# EasyEDA schematic water_counter.json
TITLE: Counter_Water; REV: 1.0; Date: 2025-07-06; Sheet: 1/1; Company: Museum of Science
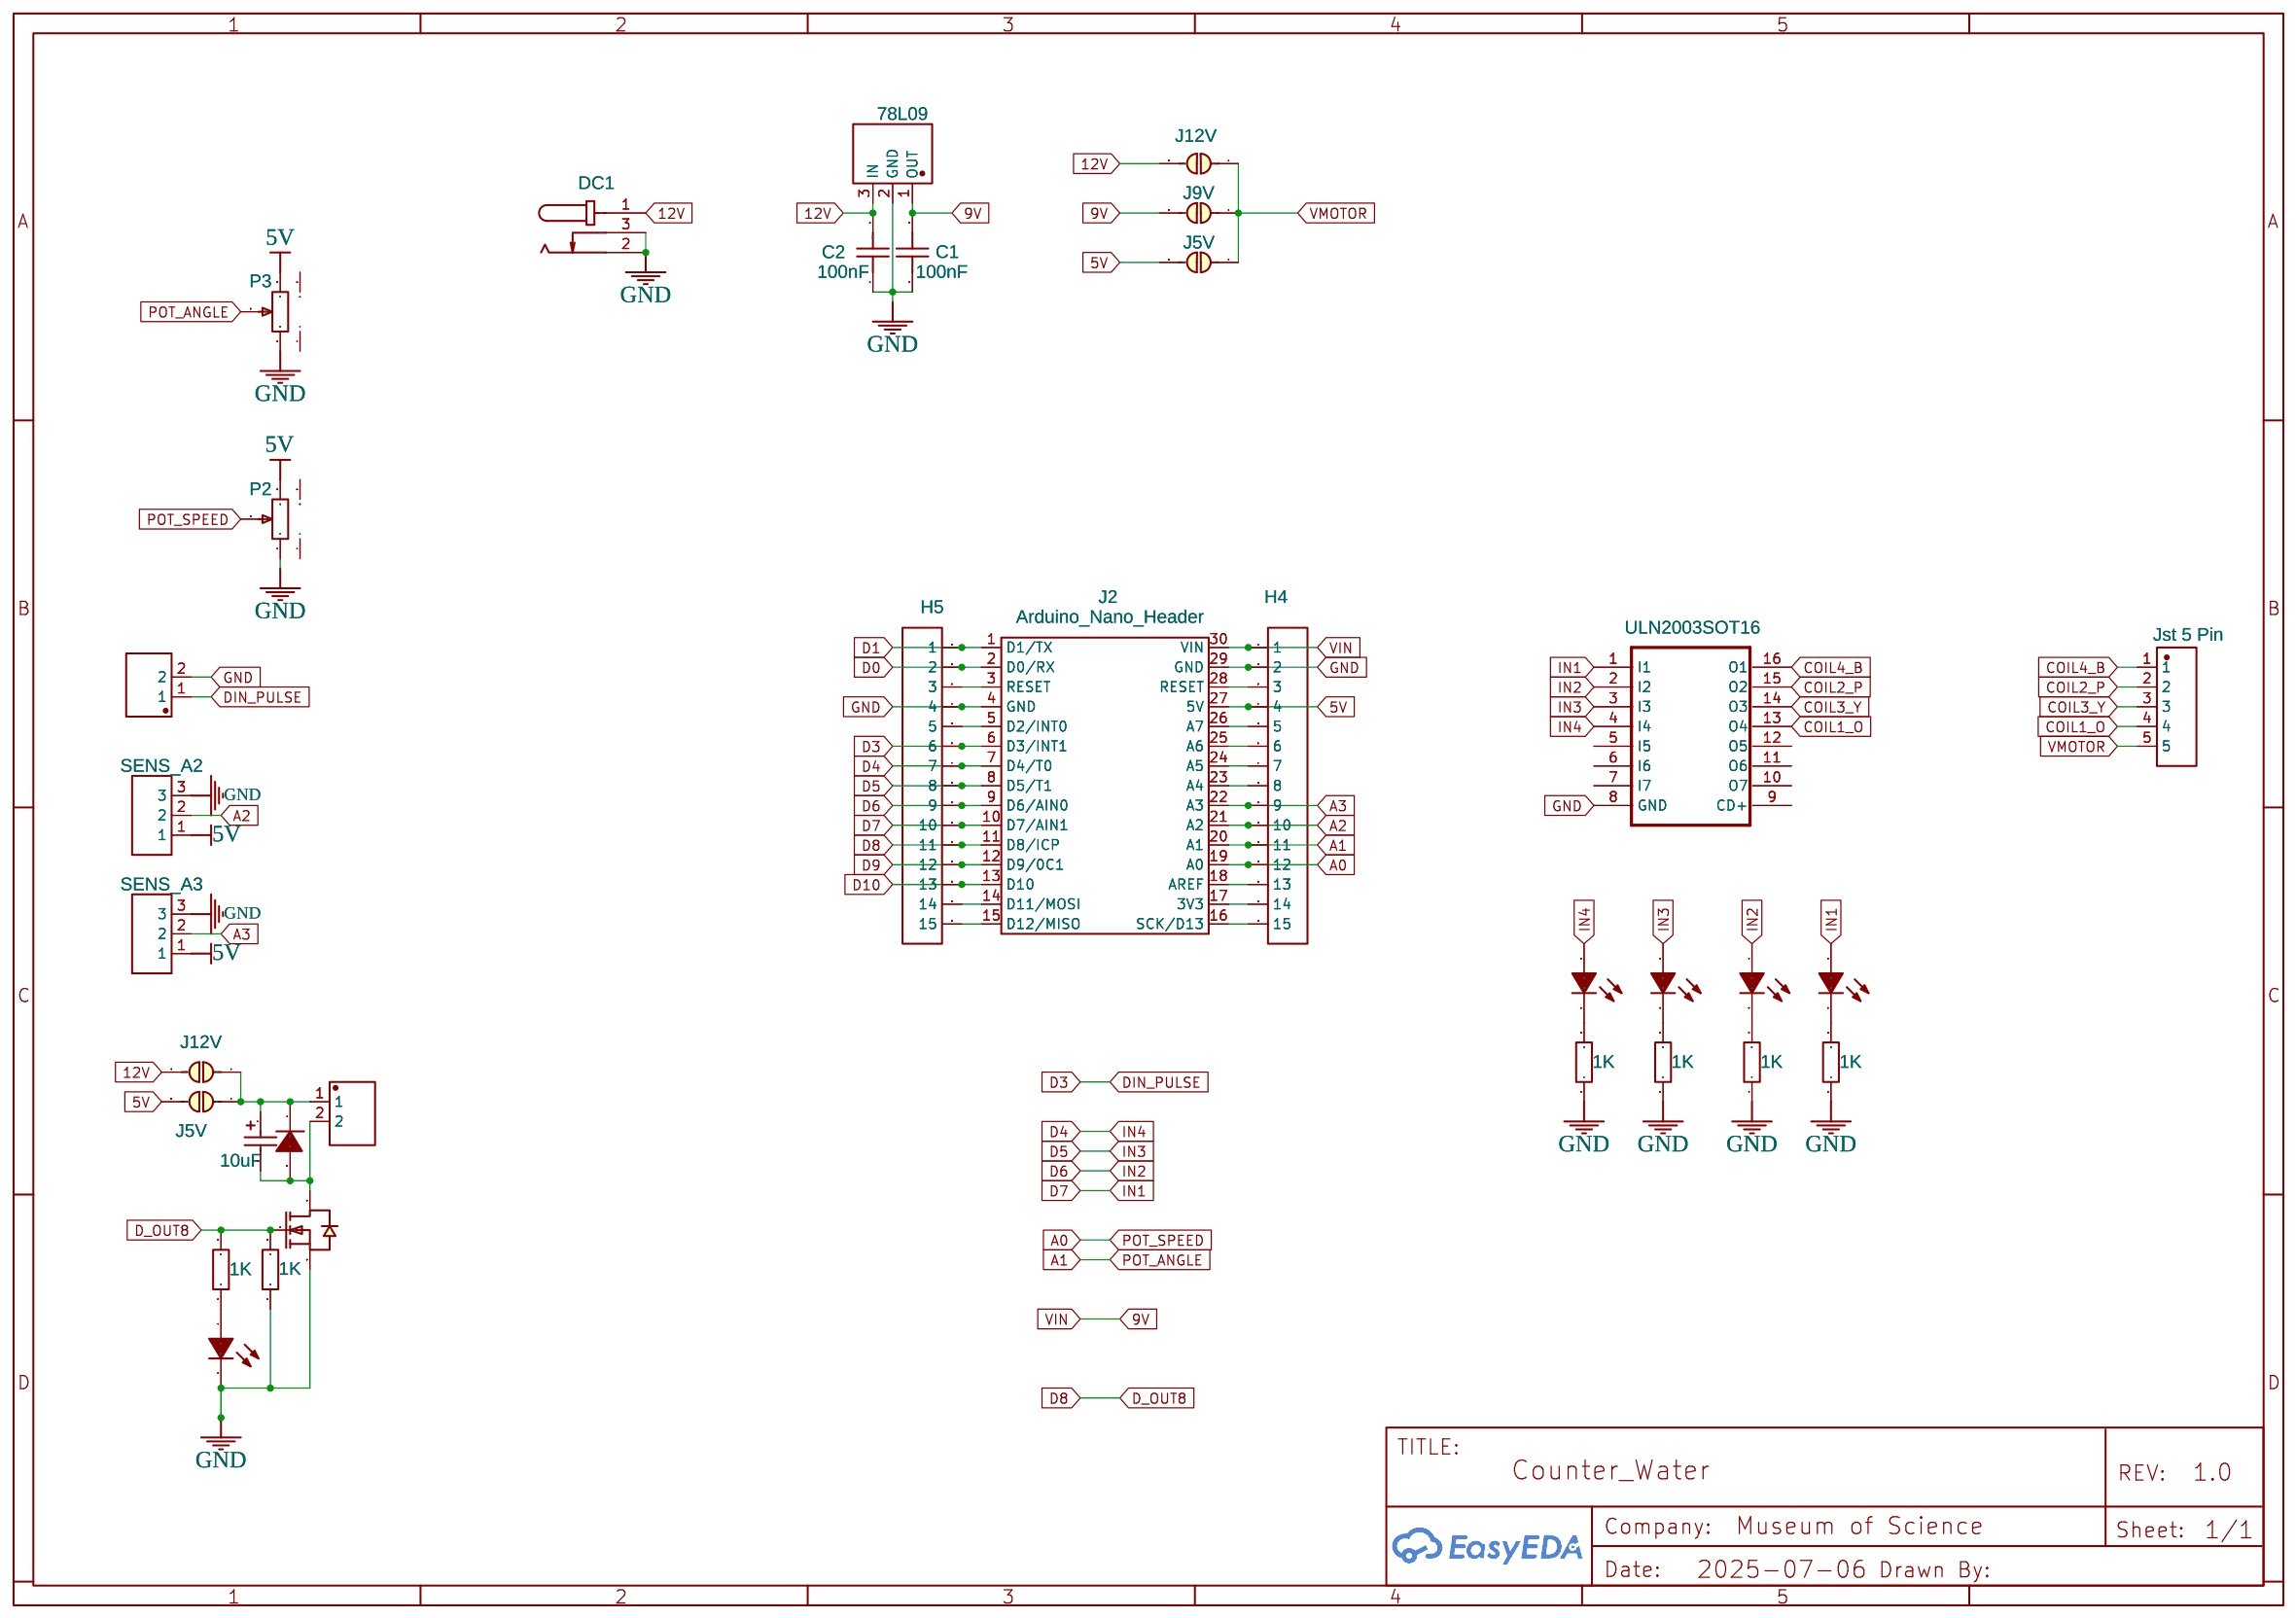
[diagram p0: schematic sheet]

## Parts
C1  100nF  [C0603]
C2  100nF  [C0603]
D3_PULSE  KF2510-2A  [CONN-TH_KF2510-2A]
DC1  DC  [DC-IN-TH_DC005]
ECM1  10uF  [CAP-SMD_L3.2-W1.6-RD-C7171]
ECON1  D_OUT8  [CONN-TH_KF2510-2A]
EDM1  1N4007  [SMAF_L3.5-W2.6-LS4.7-RD]
ELD1  LED  [LED0603-R-RD_BLUE]
ELD2  LED  [LED0603-R-RD_BLUE]
ELD3  LED  [LED0603-R-RD_BLUE]
ELD4  LED  [LED0603-R-RD_BLUE]
ELD5  LED  [LED0603-R-RD_BLUE]
EQ1  Q  [SOT-23-3_L2.9-W1.3-P0.95-LS2.4-BR]
ERG1  1K  [R0603]
ERL1  1K  [R0603]
ERL2  1K  [R0603]
ERL3  1K  [R0603]
ERL4  1K  [R0603]
ERL5  1K  [R0603]
H4  HDR-F-2.54_1x15  [HDR-F-2.54_1X15]
H5  HDR-F-2.54_1x15  [HDR-F-2.54_1X15]
IC1  ULN2003SOT16  [SOT16]
J2  Arduino_Nano_Header  [DIP-30_L43.18-W15.24-ARDUINONANO]
J5V_1  J5V  [JUMPERS_SMT-JUMPER_2_NC_PASTE_NO-SILK]
J5V_2  J5V  [JUMPERS_SMT-JUMPER_2_NC_PASTE_NO-SILK]
J9V_1  J9V  [JUMPERS_SMT-JUMPER_2_NC_PASTE_NO-SILK]
J12V_1  J12V  [JUMPERS_SMT-JUMPER_2_NC_PASTE_NO-SILK]
J12V_2  J12V  [JUMPERS_SMT-JUMPER_2_NC_PASTE_NO-SILK]
P2  长柄旋转电位器  [RES-ADJ-TH_RV09]
P3  长柄旋转电位器  [RES-ADJ-TH_RV09]
SENS_A2  FK2510  [CONN-TH_3P-P2.00_KF2510_3A]
SENS_A3  FK2510  [CONN-TH_3P-P2.00_KF2510_3A]
U1  78L09  [SOT-89-3_L4.5-W2.5-P1.50-LS4.0-BR]
U2  Jst 5 Pin  [JST 5 PIN]

## Library data of the parts
C1 C2 = CC0603KRX7R9BB104: JLCPCB Part Class: Basic Part; Package Display: No
D3_PULSE ECON1 = KF2510-2A: Supplier: LCSC; Manufacturer: BOOMELE; Supplier Part: C27543; JLCPCB Part Class: Extended Part; Package Display: No
DC1 = DC005-2.0MM: Supplier: LCSC; Manufacturer: SOFNG; Supplier Part: C111567; Package Display: No
ECM1 = TAJA106K016RNJ: JLCPCB Part Class: Basic Part; Package Display: No
EDM1 = 1N4007F: Supplier: LCSC; Manufacturer: SK; Supplier Part: C110856; JLCPCB Part Class: Extended Part; Package Display: No
ELD1-ELD5 = 19-217/BHC-ZL1M2RY/3T: Supplier: LCSC; Manufacturer: EVERLIGHT; Supplier Part: C72041; JLCPCB Part Class: Basic Part; Package Display: No
EQ1 = JSM2302: Supplier: LCSC; Supplier Part: C5224189; Manufacturer: ElecSuper(静芯微）; Manufacturer Part: AO3400; Contributor: LCSC; JLCPCB Part Class: Extended Part; Package Display: No
ERG1 ERL1-ERL5 = 0603WAF1001T5E: Supplier: LCSC; Manufacturer: UniOhm; Supplier Part: C21190; JLCPCB Part Class: Basic Part; Package Display: No
H4 H5 = HDR-F-2.54_1x15: Supplier Part: C124408; Supplier: LCSC; Contributor: LCEDA_Lib; Package Display: No
IC1 = ULN2003SOT16: Contributor: bobim; Hersteller: STMicroelectronics; Lieferant: Reichelt
J2 = Arduino_Nano_Header
J5V_1 J5V_2 J9V_1 J12V_1 J12V_2 = JUMPER-SMT_2: Contributor: P-Thomsen; Package Display: No
P2 P3 = 长柄旋转电位器: Supplier: LCSC; Supplier Part: C2874842; Manufacturer: null; JLCPCB Part Class: Extended Part; Contributor: LCSC; Package Display: No
SENS_A2 SENS_A3 = kf2510_3A: JLCPCB Part Class: Extended Part; Package Display: No
U1 = 78L09U 78L09: Contributor: LCSC; Supplier: LCSC; Supplier Part: C2875177; Manufacturer: CBI(创基); JLCPCB Part Class: Extended Part; Package Display: No
U2 = Jst 5 Pin: Manufacturer: Vicky; Supplier: Vicky; Contributor: waqasalivicky123

## Nets
5V: H4.4 J2.27(5V) J5V_1.2 J5V_2.2 P2.3 P3.3 SENS_A2.1 SENS_A3.1
9V: C1.2 H4.1 J2.30(VIN) J9V_1.2 U1.1(OUT)
12V: C2.2 DC1.1 J12V_1.2 J12V_2.2 U1.3(IN)
GND: C1.1 C2.1 D3_PULSE.2 DC1.2 DC1.3 ELD5.2(C) EQ1.2(S) ERG1.1 ERL1.1 ERL2.1 ERL3.1 ERL4.1 H4.2 H5.4 IC1.8(GND) J2.4(GND) J2.29(GND) P2.1 P3.1 SENS_A2.3 SENS_A3.3 U1.2(GND)
A0: H4.12 J2.19(A0) P2.2
A1: H4.11 J2.20(A1) P3.2
A2: H4.10 J2.21(A2) SENS_A2.2
A3: H4.9 J2.22(A3) SENS_A3.2
COIL1_O: IC1.13(O4) U2.4
COIL2_P: IC1.15(O2) U2.2
COIL3_Y: IC1.14(O3) U2.3
COIL4_B: IC1.16(O1) U2.1
D0: H5.2 J2.2(D0/RX)
D1: H5.1 J2.1(D1/TX)
D3: D3_PULSE.1 H5.6 J2.6(D3/INT1)
D4: ELD1.1(A) H5.7 IC1.4(I4) J2.7(D4/T0)
D5: ELD4.1(A) H5.8 IC1.3(I3) J2.8(D5/T1)
D6: ELD2.1(A) H5.9 IC1.2(I2) J2.9(D6/AIN0)
D7: ELD3.1(A) H5.10 IC1.1(I1) J2.10(D7/AIN1)
D8: EQ1.1(G) ERG1.2 ERL5.2 H5.11 J2.11(D8/ICP)
D9: H5.12 J2.12(D9/0C1)
D10: H5.13 J2.13(D10)
VMOTOR: J5V_1.1 J9V_1.1 J12V_1.1 U2.5
Net-(ECM1-1): ECM1.1 ECON1.1 EDM1.1(C) J5V_2.1 J12V_2.1
Net-(ECM1-2): ECM1.2 ECON1.2 EDM1.2(A) EQ1.3(D)
Net-(ELD1-2): ELD1.2(C) ERL1.2
Net-(ELD2-2): ELD2.2(C) ERL2.2
Net-(ELD3-2): ELD3.2(C) ERL3.2
Net-(ELD4-2): ELD4.2(C) ERL4.2
Net-(ELD5-1): ELD5.1(A) ERL5.1
Net-(H4-3): H4.3 J2.28(RESET)
Net-(H4-5): H4.5 J2.26(A7)
Net-(H4-6): H4.6 J2.25(A6)
Net-(H4-7): H4.7 J2.24(A5)
Net-(H4-8): H4.8 J2.23(A4)
Net-(H4-13): H4.13 J2.18(AREF)
Net-(H4-14): H4.14 J2.17(3V3)
Net-(H4-15): H4.15 J2.16(SCK/D13)
Net-(H5-3): H5.3 J2.3(RESET)
Net-(H5-5): H5.5 J2.5(D2/INT0)
Net-(H5-14): H5.14 J2.14(D11/MOSI)
Net-(H5-15): H5.15 J2.15(D12/MISO)

Not connected (* = marked no-connect by the designer): IC1 5(I5) 6(I6) 7(I7) 9(CD+) 10(O7) 11(O6) 12(O5); P2 4 5; P3 4 5
